# EAGLE schematic MiniCompCKInt_r2 (EAGLE 9.3.1)
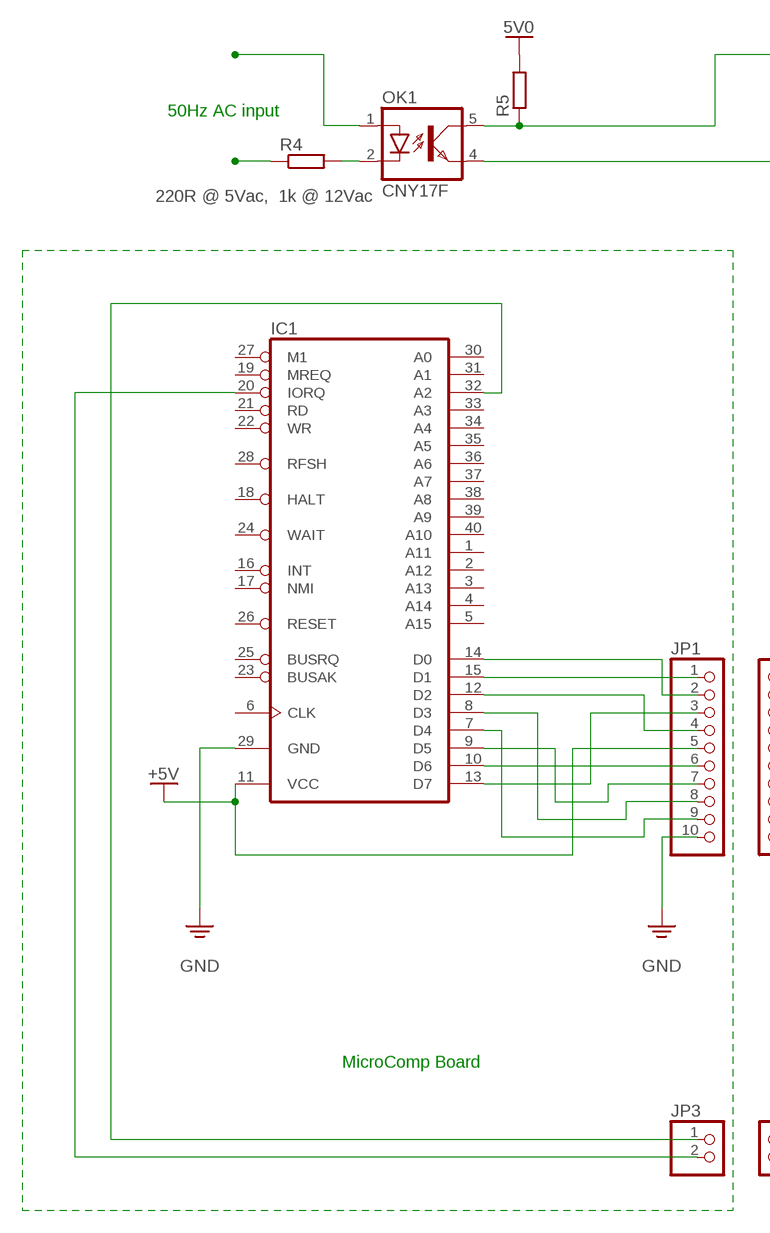
[diagram p0: schematic, sheet 1, part 1 of 2]
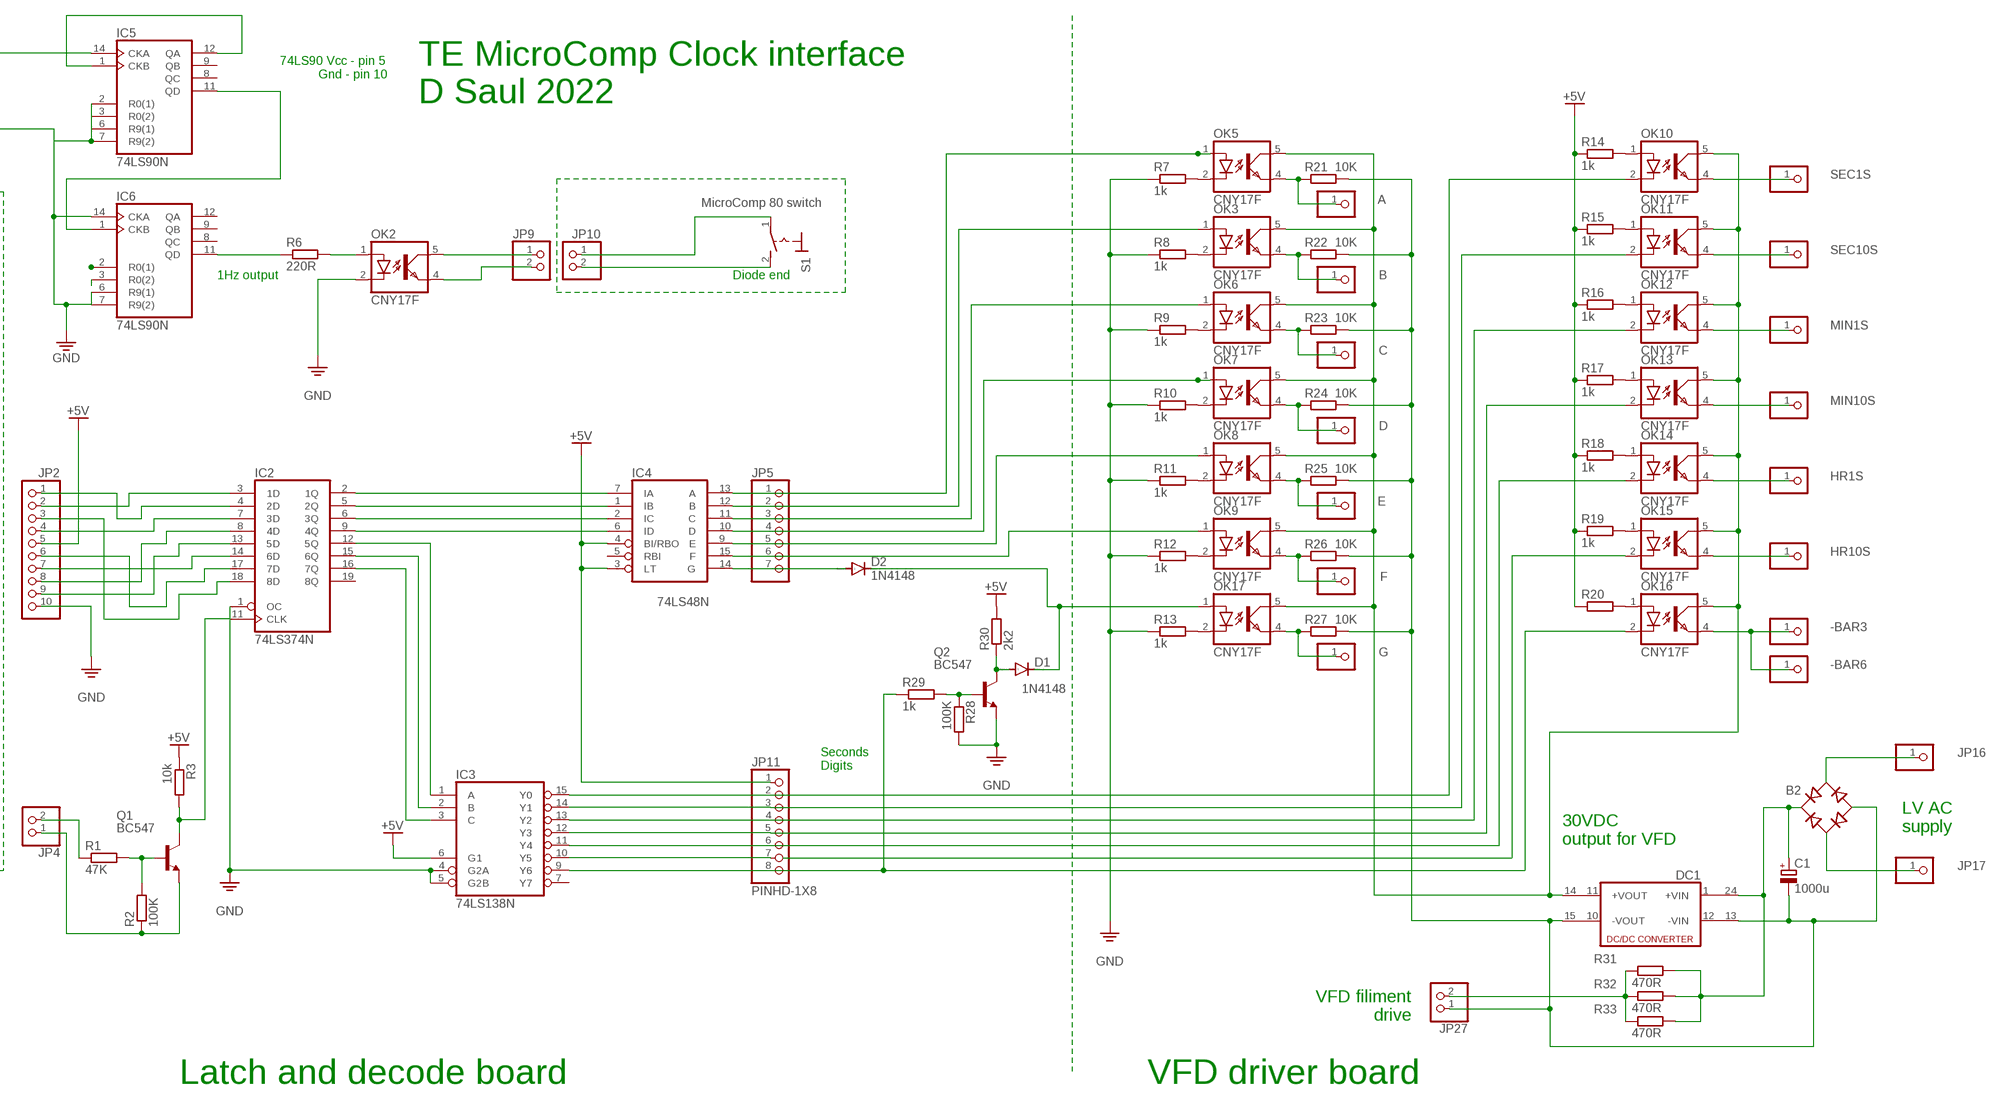
[diagram p1: schematic, sheet 1, part 2 of 2]

## Parts
-BAR3  PINHD-1X1  [1X01]
-BAR6  PINHD-1X1  [1X01]
A  PINHD-1X1  [1X01]
B  PINHD-1X1  [1X01]
B2  B1S  [MBS]
C  PINHD-1X1  [1X01]
C1  1000u  CPOL-EUE3.5-10  [E3,5-10]
D  PINHD-1X1  [1X01]
D1  1N4148  1N4148DO35-7  [DO35-7]
D2  1N4148  1N4148DO35-7  [DO35-7]
DC1  DC213R  [CMK]
E  PINHD-1X1  [1X01]
F  PINHD-1X1  [1X01]
G  PINHD-1X1  [1X01]
HR1S  PINHD-1X1  [1X01]
HR10S  PINHD-1X1  [1X01]
IC1  Z80CPU  [DIL40]
IC2  74LS374N  [DIL20]
IC3  74LS138N  [DIL16]
IC4  74LS48N  [DIL16]
IC5  74LS90N  [DIL14]
IC6  74LS90N  [DIL14]
JP1  PINHD-1X10/90  [1X10/90]
JP2  PINHD-1X10/90  [1X10/90]
JP3  PINHD-1X2/90  [1X02/90]
JP4  PINHD-1X2/90  [1X02/90]
JP5  PINHD-1X7  [1X07]
JP9  PINHD-1X2/90  [1X02/90]
JP10  PINHD-1X2/90  [1X02/90]
JP11  PINHD-1X8  [1X08]
JP16  PINHD-1X1  [1X01]
JP17  PINHD-1X1  [1X01]
JP27  PINHD-1X2/90  [1X02/90]
MIN1S  PINHD-1X1  [1X01]
MIN10S  PINHD-1X1  [1X01]
OK1  CNY17F  [DIL06]
OK2  CNY17F  [DIL06]
OK3  CNY17F  [DIL06]
OK5  CNY17F  [DIL06]
OK6  CNY17F  [DIL06]
OK7  CNY17F  [DIL06]
OK8  CNY17F  [DIL06]
OK9  CNY17F  [DIL06]
OK10  CNY17F  [DIL06]
OK11  CNY17F  [DIL06]
OK12  CNY17F  [DIL06]
OK13  CNY17F  [DIL06]
OK14  CNY17F  [DIL06]
OK15  CNY17F  [DIL06]
OK16  CNY17F  [DIL06]
OK17  CNY17F  [DIL06]
Q1  BC547  [TO92]
Q2  BC547  [TO92]
R1  47K  R-EU_0204/7  [0204/7]
R2  100K  R-EU_0204/7  [0204/7]
R3  10k  R-EU_0204/7  [0204/7]
R4  220R @ 5Vac, 1k @ 12Vac  R-EU_0204/7  [0204/7]
R5  R-EU_0204/7  [0204/7]
R6  220R  R-EU_0204/7  [0204/7]
R7  1k  R-EU_0204/7  [0204/7]
R8  1k  R-EU_0204/7  [0204/7]
R9  1k  R-EU_0204/7  [0204/7]
R10  1k  R-EU_0204/7  [0204/7]
R11  1k  R-EU_0204/7  [0204/7]
R12  1k  R-EU_0204/7  [0204/7]
R13  1k  R-EU_0204/7  [0204/7]
R14  1k  R-EU_0204/7  [0204/7]
R15  1k  R-EU_0204/7  [0204/7]
R16  1k  R-EU_0204/7  [0204/7]
R17  1k  R-EU_0204/7  [0204/7]
R18  1k  R-EU_0204/7  [0204/7]
R19  1k  R-EU_0204/7  [0204/7]
R20  1k  R-EU_0204/7  [0204/7]
R21  10K  R-EU_0204/7  [0204/7]
R22  10K  R-EU_0204/7  [0204/7]
R23  10K  R-EU_0204/7  [0204/7]
R24  10K  R-EU_0204/7  [0204/7]
R25  10K  R-EU_0204/7  [0204/7]
R26  10K  R-EU_0204/7  [0204/7]
R27  10K  R-EU_0204/7  [0204/7]
R28  100K  R-EU_0204/7  [0204/7]
R29  1k  R-EU_0204/7  [0204/7]
R30  2k2  R-EU_0204/7  [0204/7]
R31  470R  R-EU_0204/7  [0204/7]
R32  470R  R-EU_0204/7  [0204/7]
R33  470R  R-EU_0204/7  [0204/7]
S1  MicroComp 80 switch  MS243  [MS243]
SEC1S  PINHD-1X1  [1X01]
SEC10S  PINHD-1X1  [1X01]

## Nets
5V0: R5.2
+5V: IC1.11(VCC) IC3.6(G1) IC4.3(LT) IC4.4(BI/RBO) JP1.5 JP2.5 JP11.1 R3.1 R14.1 R15.1 R16.1 R17.1 R18.1 R19.1 R20.1 R30.2
GND: IC1.29(GND) IC2.1(OC) IC3.4(G2A) IC3.5(G2B) IC5.2(R0(1)) IC5.3(R0(2)) IC5.6(R9(1)) IC5.7(R9(2)) IC6.6(R9(1)) IC6.7(R9(2)) IC6.14(CKA) JP1.10 JP2.10 OK1.4(EMIT) OK2.2(C) Q2.1(E) R7.1 R8.1 R9.1 R10.1 R11.1 R12.1 R13.1 R28.2
N$1: IC1.15(D1) JP1.1
N$2: IC1.14(D0) JP1.2
N$3: IC1.13(D7) JP1.3
N$4: IC1.12(D2) JP1.4
N$5: JP4.1 Q1.1(E) R2.1
N$6: IC1.10(D6) JP1.6
N$7: IC1.9(D5) JP1.7
N$8: IC1.8(D3) JP1.8
N$9: IC1.7(D4) JP1.9
N$10: IC2.2(1Q) IC4.7(IA)
N$11: IC2.5(2Q) IC4.1(IB)
N$12: IC2.6(3Q) IC4.2(IC)
N$13: IC2.9(4Q) IC4.6(ID)
N$14: IC2.12(5Q) IC3.1(A)
N$15: IC2.15(6Q) IC3.2(B)
N$16: IC2.16(7Q) IC3.3(C)
N$17: IC2.3(1D) JP2.2
N$18: IC2.4(2D) JP2.1
N$19: IC2.7(3D) JP2.4
N$20: IC2.8(4D) JP2.8
N$21: IC2.13(5D) JP2.9
N$22: IC2.14(6D) JP2.7
N$23: IC2.17(7D) JP2.6
N$24: IC2.18(8D) JP2.3
N$25: Q1.2(B) R1.2 R2.2
N$26: OK1.1(A)
N$27: IC2.11(CLK) Q1.3(C) R3.2
N$28: IC4.13(A) JP5.1 OK5.1(A)
N$29: IC4.12(B) JP5.2 OK3.1(A)
N$30: IC4.11(C) JP5.3 OK6.1(A)
N$31: IC4.10(D) JP5.4 OK7.1(A)
N$32: IC4.9(E) JP5.5 OK8.1(A)
N$33: IC4.15(F) JP5.6 OK9.1(A)
N$34: D2.A IC4.14(G) JP5.7
N$35: OK10.1(A) R14.2
N$36: OK11.1(A) R15.2
N$37: OK5.2(C) R7.2
N$38: OK3.2(C) R8.2
N$39: IC1.32(A2) JP3.1
N$40: IC1.20(IORQ) JP3.2
N$41: JP4.2 R1.1
N$42: OK1.2(C) R4.2
N$43: IC5.14(CKA) OK1.5(COL) R5.1
N$44: IC5.1(CKB) IC5.12(QA)
N$45: IC5.11(QD) IC6.1(CKB)
N$46: IC6.11(QD) R6.1
N$47: IC6.2(R0(1)) IC6.3(R0(2))
N$48: R4.1
N$49: OK6.2(C) R9.2
N$50: OK7.2(C) R10.2
N$51: OK8.2(C) R11.2
N$52: OK9.2(C) R12.2
N$53: OK17.2(C) R13.2
N$54: OK12.1(A) R16.2
N$55: OK15.2(C)
N$56: OK13.1(A) R17.2
N$57: OK14.1(A) R18.2
N$58: OK2.1(A) R6.2
N$60: IC3.15(Y0) JP11.2 OK10.2(C)
N$61: IC3.14(Y1) JP11.3 OK11.2(C)
N$62: IC3.13(Y2) JP11.4 OK12.2(C)
N$63: IC3.12(Y3) JP11.5 OK13.2(C)
N$64: IC3.11(Y4) JP11.6 OK14.2(C)
N$65: IC3.10(Y5) JP11.7
N$66: JP9.1 OK2.5(COL)
N$67: JP9.2 OK2.4(EMIT)
N$68: JP10.1 S1.1(P)
N$69: JP10.2 S1.2(S)
N$70: OK16.1(A) R20.2
N$71: IC3.9(Y6) JP11.8 OK16.2(C) R29.1
N$72: OK15.1(A) R19.2
N$73: A.1 OK5.4(EMIT) R21.1
N$74: DC1.14(+VOUT1) OK3.5(COL) OK5.5(COL) OK6.5(COL) OK7.5(COL) OK8.5(COL) OK9.5(COL) OK10.5(COL) OK11.5(COL) OK12.5(COL) OK13.5(COL) OK14.5(COL) OK15.5(COL) OK16.5(COL) OK17.5(COL)
N$75: B2.- C1.- DC1.13(-VIN1) DC1.15(-VOUT1) JP27.1 R21.2 R22.2 R23.2 R24.2 R25.2 R26.2 R27.2
N$76: B.1 OK3.4(EMIT) R22.1
N$77: C.1 OK6.4(EMIT) R23.1
N$78: D.1 OK7.4(EMIT) R24.1
N$79: E.1 OK8.4(EMIT) R25.1
N$80: F.1 OK9.4(EMIT) R26.1
N$81: G.1 OK17.4(EMIT) R27.1
N$82: B2.AC2 JP17.1
N$83: B2.+ C1.+ DC1.24(+VIN1) R31.2 R32.2 R33.2
N$84: Q2.2(B) R28.1 R29.2
N$85: D1.A Q2.3(C) R30.1
N$86: D1.C D2.C OK17.1(A)
N$87: B2.AC1 JP16.1
N$88: OK10.4(EMIT) SEC1S.1
N$89: MIN10S.1 OK13.4(EMIT)
N$90: HR1S.1 OK14.4(EMIT)
N$91: HR10S.1 OK15.4(EMIT)
N$92: -BAR3.1 -BAR6.1 OK16.4(EMIT)
N$93: MIN1S.1 OK12.4(EMIT)
N$94: OK11.4(EMIT) SEC10S.1
N$95: JP27.2 R31.1 R32.1 R33.1
Unconnected: DC1.1(+VIN) DC1.10(-VOUT) DC1.11(+VOUT) DC1.12(-VIN) IC1.1(A11) IC1.2(A12) IC1.3(A13) IC1.4(A14) IC1.5(A15) IC1.6(CLK) IC1.16(INT) IC1.17(NMI) IC1.18(HALT) IC1.19(MREQ) IC1.21(RD) IC1.22(WR) IC1.23(BUSAK) IC1.24(WAIT) IC1.25(BUSRQ) IC1.26(RESET) IC1.27(M1) IC1.28(RFSH) IC1.30(A0) IC1.31(A1) IC1.33(A3) IC1.34(A4) IC1.35(A5) IC1.36(A6) IC1.37(A7) IC1.38(A8) IC1.39(A9) IC1.40(A10) IC2.19(8Q) IC3.7(Y7) IC4.5(RBI) IC5.8(QC) IC5.9(QB) IC6.8(QC) IC6.9(QB) IC6.12(QA)

## Notes on the sheet
- 74LS90 Vcc - pin 5
             Gnd - pin 10
- 50Hz AC input
- TE MicroComp Clock interface 
  D Saul 2022
- 1Hz output | Diode end
- MicroComp Board
- Seconds
  Digits
- LV AC
  supply
- 30VDC
  output for VFD
- VFD filiment
  drive
- Latch and decode board | VFD driver board

## Power pins joined to a net without a drawn wire
GND: IC2.10(GND) IC3.8(GND) IC4.8(GND) IC5.10(GND) IC6.10(GND)
VCC: IC2.20(VCC) IC3.16(VCC) IC4.16(VCC) IC5.5(VCC) IC6.5(VCC)

## Library data of the parts
-BAR3 -BAR6 A B C D E F G HR1S HR10S JP16 JP17 MIN1S MIN10S SEC1S SEC10S = Connector:PINHD-1X1: PIN HEADER; CATEGORY: CONNECTOR; SUB-CATEGORY: PIN-HEADER
B2 = rectifier:B*S: Surface Mount Glass Passivated Bridge Rectifiers Source: Comchip Bridge Rectifiers B05S-G_B10S-G.pdf
C1 = resistor:CPOL-EU: POLARIZED CAPACITOR, European symbol
D1 D2 = diode:1N4148: DIODE high speed (Philips)
DC1 = dc-dc-converter:DC213R: DC-DC CONVERTER; OC_FARNELL: unknown; OC_NEWARK: unknown
IC1 = zilog:Z80CPU: Z80 FAMILY DEVICE
IC2 = 74xx-us:74*374: Octal D type transparent LATCH, edge triggered
IC3 = 74xx-us:74*138: 3-line to 8-line DECODER/DEMULTIPLEXER
IC4 = 74xx-us:74*48: BCD to seven segment DECODER/DRIVER
IC5 IC6 = 74xx-eu:74*90: Decade, divide by twelve and binary COUNTER
JP1 JP2 = Connector:PINHD-1X10: PIN HEADER; CATEGORY: CONNECTOR; SUB-CATEGORY: PIN-HEADER
JP3 JP4 JP9 JP10 JP27 = Connector:PINHD-1X2: PIN HEADER; CATEGORY: CONNECTOR; SUB-CATEGORY: PIN-HEADER
JP5 = Connector:PINHD-1X7: PIN HEADER; CATEGORY: CONNECTOR; SUB-CATEGORY: PIN-HEADER
JP11 = Connector:PINHD-1X8: PIN HEADER; CATEGORY: CONNECTOR; SUB-CATEGORY: PIN-HEADER
OK1-OK3 OK5-OK17 = optocoupler:CNY17F: SIEMENS OPTO COUPLER; MF: VISHAY/TELEFUNKEN; MPN: CNY17F-3; OC_FARNELL: 1469473; OC_NEWARK: 58K0172
Q1 Q2 = transistor-npn:BC547*: NPN Transistor
R1-R33 = resistor:R-EU_: RESISTOR, European symbol
S1 = switch:MS243: TOGGLE SWITCH